# EAGLE design rpi2_ctrl (EAGLE 7.6.0)
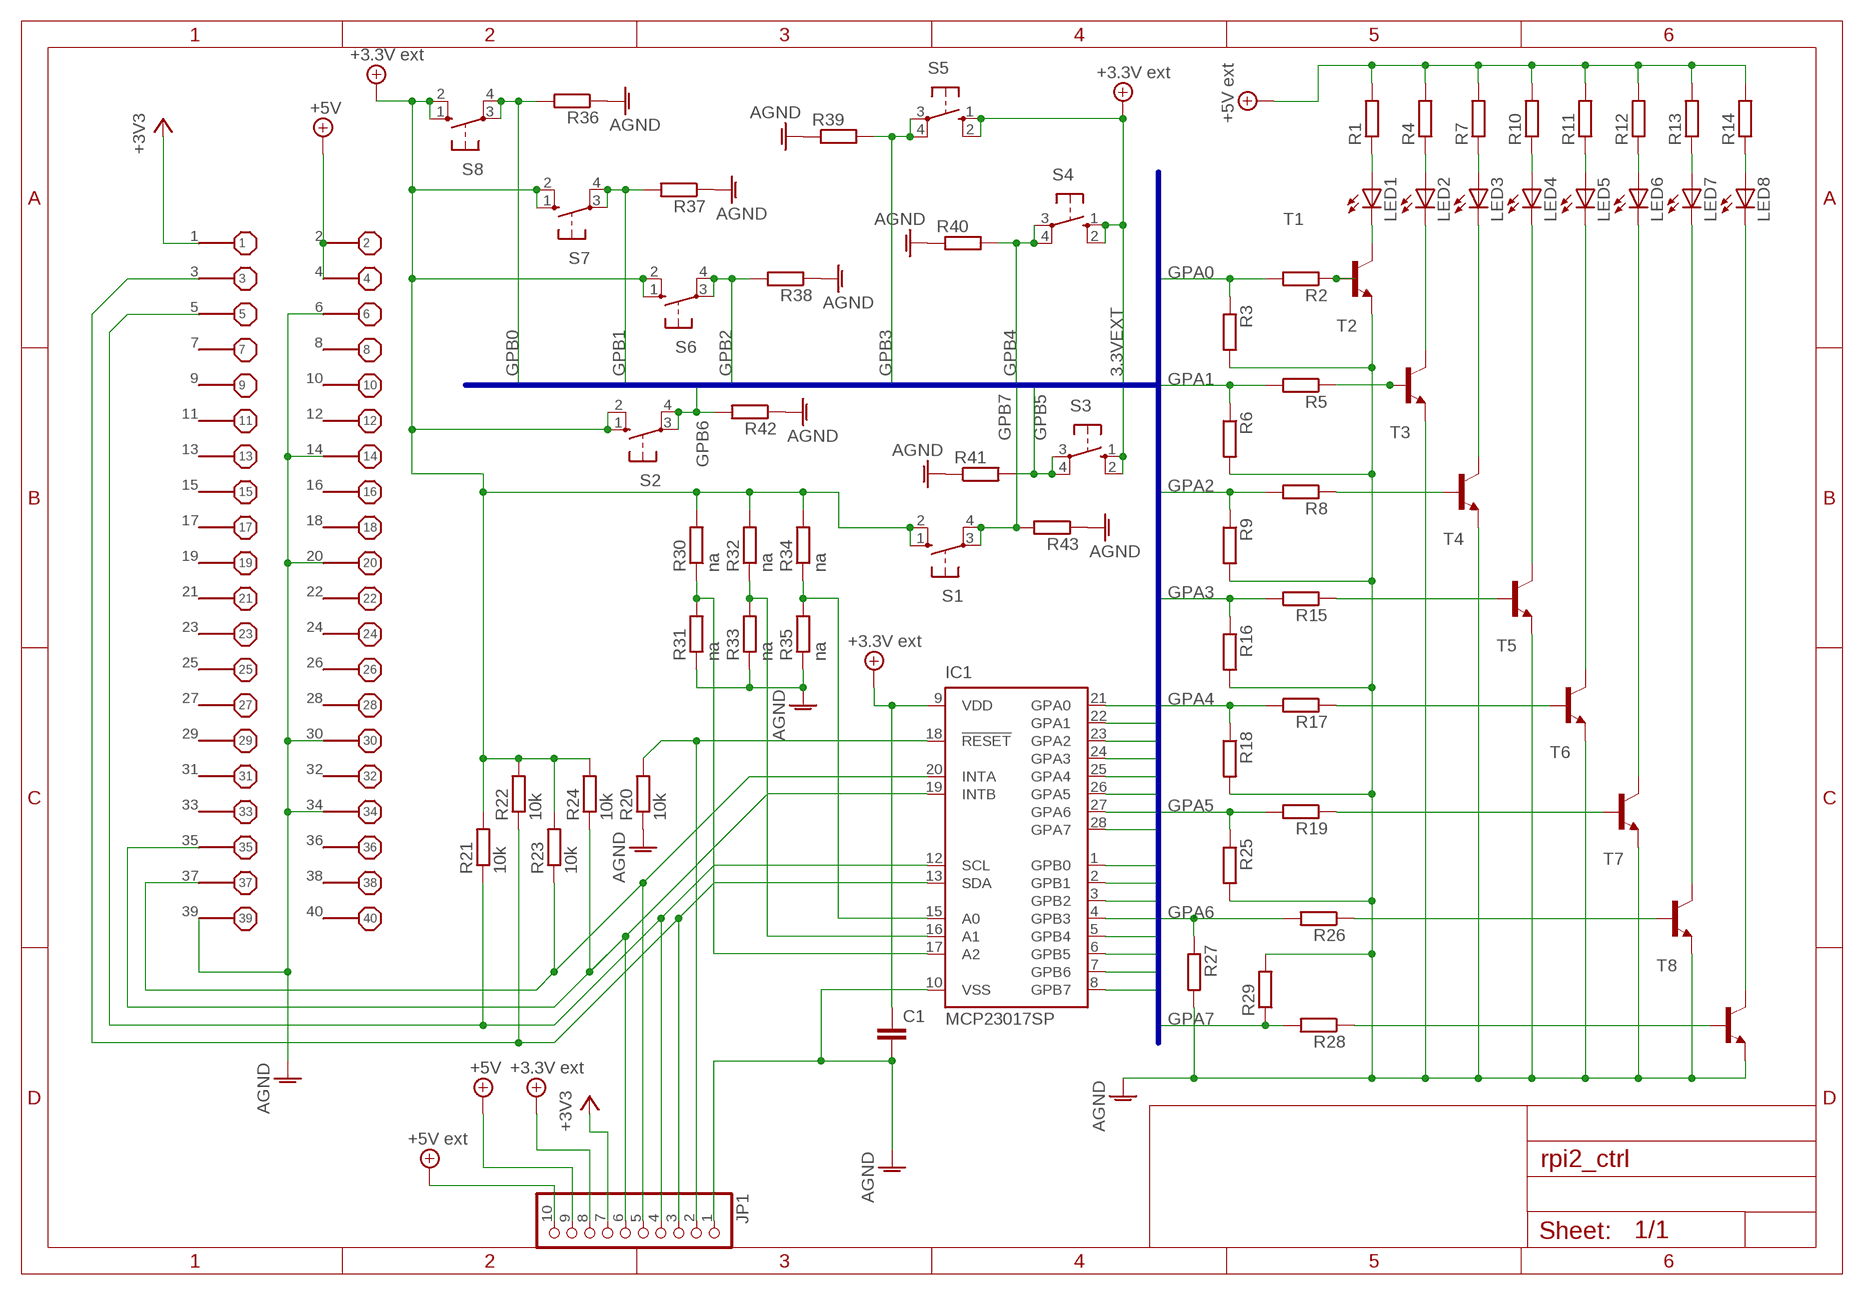
[diagram p0: schematic, sheet 1]

## Parts
C1  C-EUC1210  [C1210]
IC1  MCP23017SP  [DIL28-3]
JP1  PINHD-1X10  [1X10]
LED1  LED5MM  [LED5MM]
LED2  LED5MM  [LED5MM]
LED3  LED5MM  [LED5MM]
LED4  LED5MM  [LED5MM]
LED5  LED5MM  [LED5MM]
LED6  LED5MM  [LED5MM]
LED7  LED5MM  [LED5MM]
LED8  LED5MM  [LED5MM]
R1  R-EU_R0805  [R0805]
R2  R-EU_R0805  [R0805]
R3  R-EU_R0805  [R0805]
R4  R-EU_R0805  [R0805]
R5  R-EU_R0805  [R0805]
R6  R-EU_R0805  [R0805]
R7  R-EU_R0805  [R0805]
R8  R-EU_R0805  [R0805]
R9  R-EU_R0805  [R0805]
R10  R-EU_R0805  [R0805]
R11  R-EU_R0805  [R0805]
R12  R-EU_R0805  [R0805]
R13  R-EU_R0805  [R0805]
R14  R-EU_R0805  [R0805]
R15  R-EU_R0805  [R0805]
R16  R-EU_R0805  [R0805]
R17  R-EU_R0805  [R0805]
R18  R-EU_R0805  [R0805]
R19  R-EU_R0805  [R0805]
R20  10k  R-EU_R0805  [R0805]
R21  10k  R-EU_R0805  [R0805]
R22  10k  R-EU_R0805  [R0805]
R23  10k  R-EU_R0805  [R0805]
R24  10k  R-EU_R0805  [R0805]
R25  R-EU_R0805  [R0805]
R26  R-EU_R0805  [R0805]
R27  R-EU_R0805  [R0805]
R28  R-EU_R0805  [R0805]
R29  R-EU_R0805  [R0805]
R30  na  R-EU_R0805  [R0805]
R31  na  R-EU_R0805  [R0805]
R32  na  R-EU_R0805  [R0805]
R33  na  R-EU_R0805  [R0805]
R34  na  R-EU_R0805  [R0805]
R35  na  R-EU_R0805  [R0805]
R36  R-EU_R0805  [R0805]
R37  R-EU_R0805  [R0805]
R38  R-EU_R0805  [R0805]
R39  R-EU_R0805  [R0805]
R40  R-EU_R0805  [R0805]
R41  R-EU_R0805  [R0805]
R42  R-EU_R0805  [R0805]
R43  R-EU_R0805  [R0805]
S1  10-XX  [B3F-10XX]
S2  10-XX  [B3F-10XX]
S3  10-XX  [B3F-10XX]
S4  10-XX  [B3F-10XX]
S5  10-XX  [B3F-10XX]
S6  10-XX  [B3F-10XX]
S7  10-XX  [B3F-10XX]
S8  10-XX  [B3F-10XX]
T1  BC547-NPN-TO92-CBE  [TO92-CBE]
T2  BC547-NPN-TO92-CBE  [TO92-CBE]
T3  BC547-NPN-TO92-CBE  [TO92-CBE]
T4  BC547-NPN-TO92-CBE  [TO92-CBE]
T5  BC547-NPN-TO92-CBE  [TO92-CBE]
T6  BC547-NPN-TO92-CBE  [TO92-CBE]
T7  BC547-NPN-TO92-CBE  [TO92-CBE]
T8  BC547-NPN-TO92-CBE  [TO92-CBE]
X1  B+_GPIO  [B+_GPIO]

## Nets
3.3VEXT: C1.1 IC1.9(VDD) JP1.8 R21.2 R22.2 R23.2 R24.2 R30.2 R32.2 R34.2 S1.1(S) S1.2(S1) S2.1(S) S2.2(S1) S3.1(S) S3.2(S1) S4.1(S) S4.2(S1) S5.1(S) S5.2(S1) S6.1(S) S6.2(S1) S7.1(S) S7.2(S1) S8.1(S) S8.2(S1) ; supply symbol labelled +3.3V ext
+3V3: JP1.7 X1.1
+5V: JP1.9 X1.2 X1.4
+5V/1: JP1.10 R1.2 R4.2 R7.2 R10.2 R11.2 R12.2 R13.2 R14.2 ; supply symbol labelled +5V ext
AGND: C1.2 IC1.10(VSS) JP1.1 R3.2 R6.2 R9.2 R16.2 R18.2 R20.1 R25.2 R27.2 R29.2 R31.1 R33.1 R35.1 R36.1 R37.1 R38.1 R39.1 R40.1 R41.1 R42.1 R43.1 T1.E T2.E T3.E T4.E T5.E T6.E T7.E T8.E X1.6 X1.14 X1.20 X1.30 X1.34 X1.39
GPA0: IC1.21(GPA0) R2.2 R3.1
GPA1: IC1.22(GPA1) R5.2 R6.1
GPA2: IC1.23(GPA2) R8.2 R9.1
GPA3: IC1.24(GPA3) R15.2 R16.1
GPA4: IC1.25(GPA4) R17.2 R18.1
GPA5: IC1.26(GPA5) R19.2 R25.1
GPA6: IC1.27(GPA6) R26.2 R27.1
GPA7: IC1.28(GPA7) R28.2 R29.1
GPB0: IC1.1(GPB0) R36.2 S8.3(P) S8.4(P1)
GPB1: IC1.2(GPB1) R37.2 S7.3(P) S7.4(P1)
GPB2: IC1.3(GPB2) R38.2 S6.3(P) S6.4(P1)
GPB3: IC1.4(GPB3) R39.2 S5.3(P) S5.4(P1)
GPB4: IC1.5(GPB4) R40.2 S4.3(P) S4.4(P1)
GPB5: IC1.6(GPB5) R41.2 S3.3(P) S3.4(P1)
GPB6: IC1.7(GPB6) R42.2 S2.3(P) S2.4(P1)
GPB7: IC1.8(GPB7) R43.2 S1.3(P) S1.4(P1)
N$1: R2.1 T1.B
N$2: LED1.A R1.1
N$3: IC1.13(SDA) JP1.3 R22.1 X1.3
N$4: IC1.12(SCL) JP1.4 R21.1 X1.5
N$5: IC1.19(INTB) JP1.6 R24.1 X1.35
N$6: IC1.20(INTA) JP1.5 R23.1 X1.37
N$7: IC1.18(!RESET) JP1.2 R20.2
N$8: LED1.K(C) T1.C
N$9: R5.1 T2.B
N$10: LED2.A R4.1
N$11: LED2.K(C) T2.C
N$12: R8.1 T3.B
N$13: LED3.A R7.1
N$14: LED3.K(C) T3.C
N$15: R15.1 T4.B
N$16: LED4.K(C) T4.C
N$17: R17.1 T5.B
N$18: LED5.K(C) T5.C
N$19: R19.1 T6.B
N$20: LED6.K(C) T6.C
N$21: R26.1 T7.B
N$22: LED7.K(C) T7.C
N$23: IC1.17(A2) R30.1 R31.2
N$24: R28.1 T8.B
N$25: LED8.K(C) T8.C
N$26: LED8.A R14.1
N$27: LED7.A R13.1
N$28: LED6.A R12.1
N$29: IC1.16(A1) R32.1 R33.2
N$30: IC1.15(A0) R34.1 R35.2
N$31: LED5.A R11.1
N$32: LED4.A R10.1
Unconnected: X1.7 X1.8 X1.9 X1.10 X1.11 X1.12 X1.13 X1.15 X1.16 X1.17 X1.18 X1.19 X1.21 X1.22 X1.23 X1.24 X1.25 X1.26 X1.27 X1.28 X1.29 X1.31 X1.32 X1.33 X1.36 X1.38 X1.40

## Buses
GPA[0..7],GPB[0..7]

## Library data of the parts
C1 = rcl:C-EU: CAPACITOR, European symbol
IC1 = microchip:MCP23017: http://ww1.microchip.com/downloads/en/DeviceDoc/21952a.pdf Source: http://ww1.microchip.com/downloads/en/DeviceDoc/21952a.pdf; MF: MICROCHIP; MPN: MCP23017-E/SP; OC_FARNELL: 1332088; OC_NEWARK: 31K2959
JP1 = pinhead:PINHD-1X10: PIN HEADER
LED1-LED8 = led:LED: LED OSRAM: - CHIPLED LG R971, LG N971, LY N971, LG Q971, LY Q971, LO R971, LY R971 LH N974, LH R974 LS Q976, LO Q976, LY Q976 LO Q996 - Hyper CHIPLED LW Q18S LB Q993, LB Q99A, LB R99A - SideLED LS A670, LO A670, LY A670, LG A670, LP A670 LB A673, LV A673, LT A673, LW A673 LH A674 LY A675 LS A676, LA A676, LO A676, LY A676, LW A676 LS A679, LY A679, LG A679 - Hyper Micro SIDELED® LS Y876, LA Y876, LO Y876, LY Y876 LT Y87S - SmartLED LW L88C, LW L88S LB L89C, LB L89S, LG L890 LS L89K, LO L89K, LY L89K LS L896, LA L896, LO L896, LY L896 - TOPLED LS T670, LO T670, LY T670, LG T670, LP T670 LSG T670, LSP T670, LSY T670, LOP T670, LYG T670 LG T671, LOG T671, LSG T671 LB T673, LV T673, LT T673, LW T673 LH T674 LS T676, LA T676, LO T676, LY T676, LB T676, LH T676, LSB T676, LW T676 LB T67C, LV T67C, LT T67C, LS T67K, LO T67K, LY T67K, LW E67C LS E67B, LA E67B, LO E67B, LY E67B, LB E67C, LV E67C, LT E67C LW T67C LS T679, LY T679, LG T679 LS T770, LO T770, LY T770, LG T770, LP T770 LB T773, LV T773, LT T773, LW T773 LH T774 LS E675, LA E675, LY E675, LS T675 LS T776, LA T776, LO T776, LY T776, LB T776 LHGB T686 LT T68C, LB T68C - Hyper Mini TOPLED® LB M676 - Mini TOPLED Santana® LG M470 LS M47K, LO M47K, LY M47K Source: http://www.osram.convergy.de LUXEON: - LUMILED® LXK2-PW12-R00, LXK2-PW12-S00, LXK2-PW14-U00, LXK2-PW14-V00 LXK2-PM12-R00, LXK2-PM12-S00, LXK2-PM14-U00 LXK2-PE12-Q00, LXK2-PE12-R00, LXK2-PE12-S00, LXK2-PE14-T00, LXK2-PE14-U00 LXK2-PB12-K00, LXK2-PB12-L00, LXK2-PB12-M00, LXK2-PB14-N00, LXK2-PB14-P00, LXK2-PB14-Q00 LXK2-PR12-L00, LXK2-PR12-M00, LXK2-PR14-Q00, LXK2-PR14-R00 LXK2-PD12-Q00, LXK2-PD12-R00, LXK2-PD12-S00 LXK2-PH12-R00, LXK2-PH12-S00 LXK2-PL12-P00, LXK2-PL12-Q00, LXK2-PL12-R00 Source: www.luxeon.com KINGBRIGHT: KA-3528ASYC Source: www.kingbright.com
R1-R43 = rcl:R-EU_: RESISTOR, European symbol
S1-S8 = switch-omron:10-XX: OMRON SWITCH; MPN: B3F-1000; OC_FARNELL: 176432; OC_NEWARK: 36M3542
T1-T8 = transistor:*-NPN-: NPN Transistror BF959 corrected 2008.03.06
X1 = raspberry:B+_GPIO

## Board
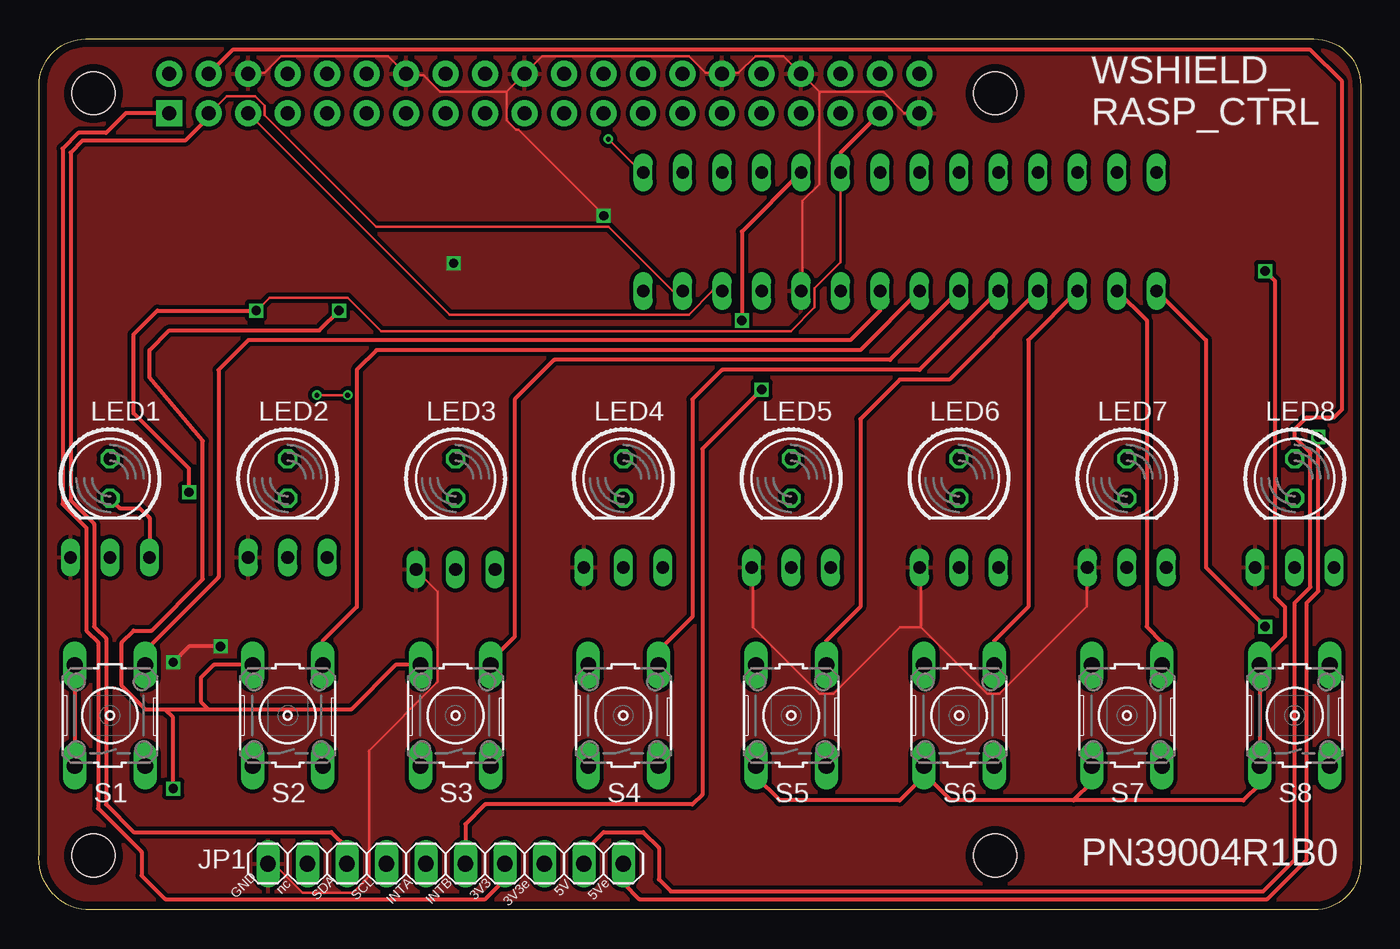
[diagram p1: board, top side]
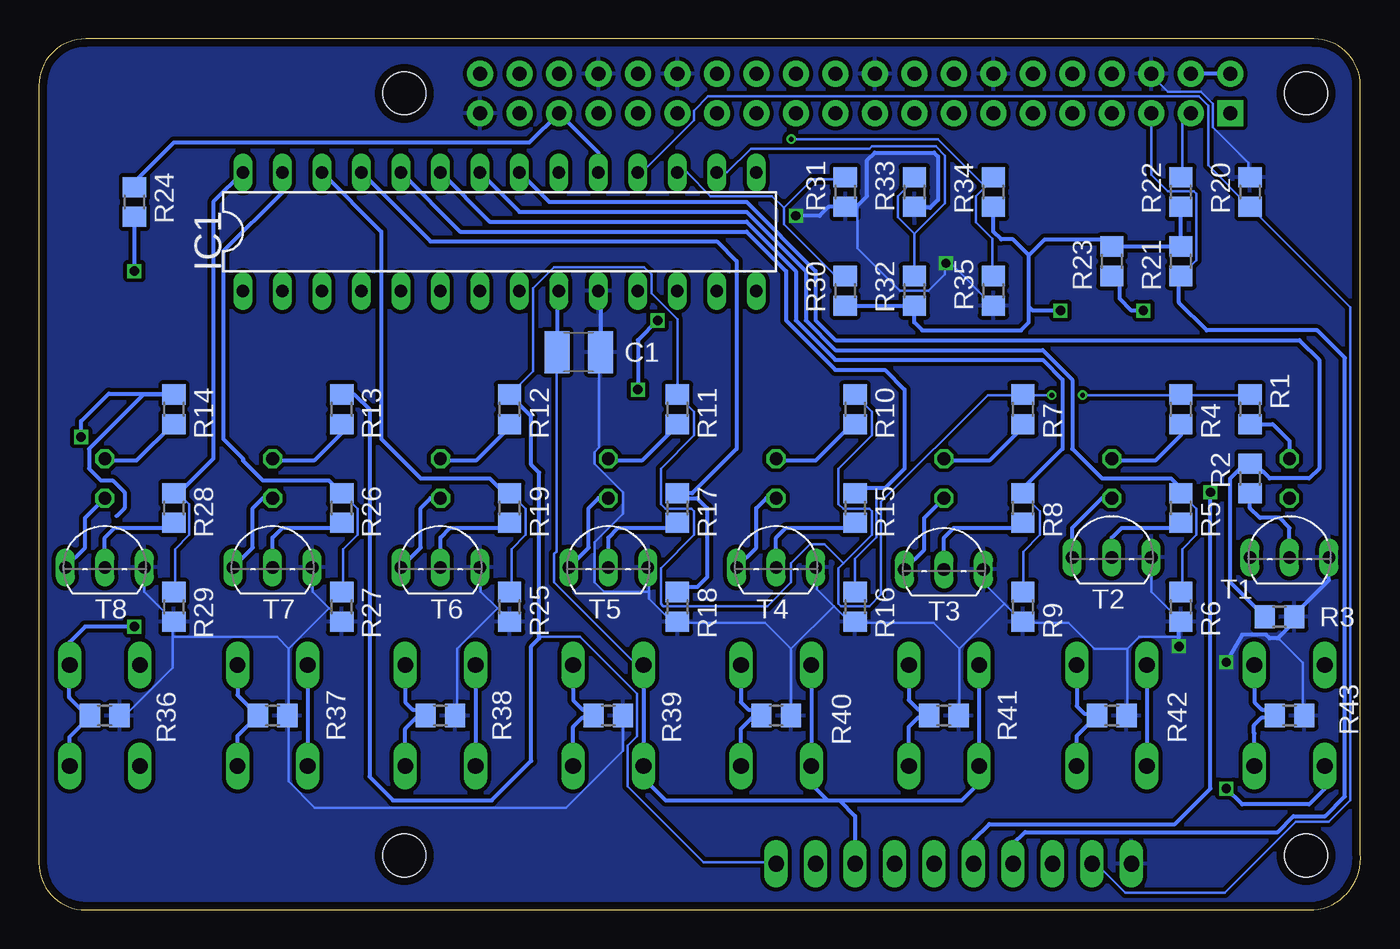
[diagram p2: board, bottom side, seen from below]

Size 85.02 x 56 mm. Coordinates in mm from the lower left corner, seen from the top.
Outline: 0.02,53 arc-90 3.02,56 82.02,56 arc-90 85.02,53 85.02,3 arc-90 82.02,0 3.02,0 arc-90 0.02,3.64 0.02,53
Copper layers (1*16): Top 0.035mm / dielectric 1.6mm / Bottom 0.035mm
Design rules "Elecrow_2-layer_PCB_eagle_rule": minimum track width 6mil, minimum drill 12mil, track to track 6mil, track to pad 6mil, pad to pad 6mil, via to via 8mil, smd to smd 0mil, copper to edge 20mil, drill to drill 10mil, minimum pad ring 6mil, minimum via ring 6mil, stop-mask expansion 0mil, vias tented up to drill 100mil, thermal gap 10mil
Holes 2.75 mm at 3.52,52.5 3.52,3.5 61.52,52.5 61.52,3.5

### Footprints (pad centres in the part's own frame; a part is rotated, then mirrored left to right if it is on the bottom)
C1210 = smd 1.6 x 2.7: 1 -1.4,0; 2 1.4,0
DIL28-3 = drill 0.813 long: 1 -16.51,-3.81; 2 -13.97,-3.81; 3 -11.43,-3.81; 4 -8.89,-3.81; 5 -6.35,-3.81; 6 -3.81,-3.81; 7 -1.27,-3.81; 8 1.27,-3.81; 9 3.81,-3.81; 10 6.35,-3.81; 11 8.89,-3.81; 12 11.43,-3.81; 13 13.97,-3.81; 14 16.51,-3.81; 15 16.51,3.81; 16 13.97,3.81; 17 11.43,3.81; 18 8.89,3.81; 19 6.35,3.81; 20 3.81,3.81; 21 1.27,3.81; 22 -1.27,3.81; 23 -3.81,3.81; 24 -6.35,3.81; 25 -8.89,3.81; 26 -11.43,3.81; 27 -13.97,3.81; 28 -16.51,3.81
1X10 = drill 1.016 long: 1 -11.43,0; 2 -8.89,0; 3 -6.35,0; 4 -3.81,0; 5 -1.27,0; 6 1.27,0; 7 3.81,0; 8 6.35,0; 9 8.89,0; 10 11.43,0
LED5MM = drill 0.813 octagon: A -1.27,0; K 1.27,0
R0805 = smd 1.3 x 1.5: 1 -0.95,0; 2 0.95,0
B3F-10XX = drill 1.016 long: 1 -3.251,2.261; 2 3.251,2.261; 3 -3.251,-2.261; 4 3.251,-2.261
TO92-CBE = drill 0.813 long: B 0,0; C -2.54,0; E 2.54,0
B+_GPIO = drill 0.9 pad 1.676 square: 1 -24.13,-1.27 | drill 0.9 pad 1.676: 2 -24.13,1.27; 3 -21.59,-1.27; 4 -21.59,1.27; 5 -19.05,-1.27; 6 -19.05,1.27; 7 -16.51,-1.27; 8 -16.51,1.27; 9 -13.97,-1.27; 10 -13.97,1.27; 11 -11.43,-1.27; 12 -11.43,1.27; 13 -8.89,-1.27; 14 -8.89,1.27; 15 -6.35,-1.27; 16 -6.35,1.27; 17 -3.81,-1.27; 18 -3.81,1.27; 19 -1.27,-1.27; 20 -1.27,1.27; 21 1.27,-1.27; 22 1.27,1.27; 23 3.81,-1.27; 24 3.81,1.27; 25 6.35,-1.27; 26 6.35,1.27; 27 8.89,-1.27; 28 8.89,1.27; 29 11.43,-1.27; 30 11.43,1.27; 31 13.97,-1.27; 32 13.97,1.27; 33 16.51,-1.27; 34 16.51,1.27; 35 19.05,-1.27; 36 19.05,1.27; 37 21.59,-1.27; 38 21.59,1.27; 39 24.13,-1.27; 40 24.13,1.27

### Placement (x,y rotation side)
C1  50.3,35.86 0 bottom
IC1  55.38,43.61 0 bottom
JP1  26.17,2.97 0 top
LED1  4.58,27.73 270 top
LED2  16.01,27.73 270 top
LED3  26.8,27.73 270 top
LED4  37.6,27.73 270 top
LED5  48.39,27.73 270 top
LED6  59.19,27.73 270 top
LED7  69.98,27.73 270 top
LED8  80.78,27.73 270 top
R1  7.12,32.18 90 bottom
R2  7.12,27.73 90 bottom
R3  5.21,18.84 0 bottom
R4  11.56,32.18 90 bottom
R5  11.56,25.83 90 bottom
R6  11.56,19.48 270 bottom
R7  21.72,32.18 90 bottom
R8  21.72,25.83 90 bottom
R9  21.72,19.48 270 bottom
R10  32.52,32.18 90 bottom
R11  43.95,32.18 90 bottom
R12  54.74,32.18 90 bottom
R13  65.54,32.18 90 bottom
R14  76.33,32.18 90 bottom
R15  32.52,25.83 90 bottom
R16  32.52,19.48 270 bottom
R17  43.95,25.83 90 bottom
R18  43.95,19.48 270 bottom
R19  54.74,25.83 90 bottom
R20  7.12,46.15 270 bottom
R21  11.56,41.7 90 bottom
R22  11.56,46.15 270 bottom
R23  16.01,41.7 90 bottom
R24  78.87,45.52 270 bottom
R25  54.74,19.48 270 bottom
R26  65.54,25.83 90 bottom
R27  65.54,19.48 270 bottom
R28  76.33,25.83 90 bottom
R29  76.33,19.48 270 bottom
R30  33.15,39.8 270 bottom
R31  33.15,46.15 90 bottom
R32  28.71,39.8 270 bottom
R33  28.71,46.15 90 bottom
R34  23.63,46.15 270 bottom
R35  23.63,39.8 90 bottom
R36  80.78,12.5 180 bottom
R37  69.98,12.5 180 bottom
R38  59.19,12.5 180 bottom
R39  48.39,12.5 180 bottom
R40  37.6,12.5 180 bottom
R41  26.8,12.5 180 bottom
R42  16.01,12.5 180 bottom
R43  4.58,12.5 180 bottom
S1  4.58,12.5 90 top
S2  16.01,12.5 90 top
S3  26.8,12.5 90 top
S4  37.6,12.5 90 top
S5  48.39,12.5 90 top
S6  59.19,12.5 90 top
S7  69.98,12.5 90 top
S8  80.78,12.5 90 top
T1  4.58,22.66 0 bottom
T2  16.01,22.66 0 bottom
T3  26.8,21.89 0 bottom
T4  37.6,22.02 0 bottom
T5  48.39,22.02 0 bottom
T6  59.19,22.02 0 bottom
T7  69.98,22.02 0 bottom
T8  80.78,22.02 0 bottom
X1  32.52,52.5 0 top

### Tracks (layer width: path | path; a pad name or v marks a point on that pad's centre or on a via)
3.3VEXT  (via drill 0.6)
  Top 0.254: S3.2 22.94,15.75 20.07,12.88 10.93,12.88 | 10.93,12.88 8.13,12.88 | 8.13,12.88 6.86,12.88 5.34,14.4 5.34,17.19 6.1,17.96 7.24,17.96 10.54,21.26 10.54,30.15 7.12,34.21 7.12,35.99 8.39,37.26 18.04,37.26 v19.31,38.53 | S5.1 46.13,8.56 47.65,7.03 55.38,7.03 56.92,8.58 S6.1 56.9,9.22 56.9,8.81 58.68,7.03 66.55,7.03 | S7.1 67.72,8.2 66.55,7.03 | S2.2 11.26,15.75 10.42,14.91 10.42,13.38 10.93,12.88 | v8.64,7.8 8.64,12.37 8.13,12.88 | S1.2 S1.1 | 66.55,7.03 77.47,7.03 78.51,8.08 S8.1 S8.2 78.51,15.95 80.14,17.57 80.14,19.48 79.51,20.12 79.51,40.44 v78.87,41.07
  Bottom 0.152: C1.1 51.72,35.84 51.72,23.04 51.87,22.88 51.87,21.05 46.69,15.87 46.23,15.87 S5.2
  Bottom 0.254: S7.2 S7.1 | S6.2 S6.1 | S2.2 S2.1 | R30.2 R32.2 28.71,37.77 28.2,37.26 21.85,37.26 21.34,37.77 21.34,38.78 | R22.2 R21.2 R23.2 16.01,42.59 16.39,42.98 | S5.2 S5.1 46.13,8.46 44.71,7.03 34.29,7.03 | S4.2 S4.1 35.33,8.08 34.29,7.03 | S3.2 S3.1 24.64,9.14 24.64,8.05 25.66,7.03 33.53,7.03 | 21.34,38.78 21.34,42.09 | 21.34,42.09 22.36,43.1 23.12,43.1 23.63,43.61 R34.2 | 21.34,42.09 20.32,43.1 16.39,43.1 16.39,42.98 | 16.45,43.1 16.51,43.1 16.39,42.98 | v19.31,38.53 21.09,38.53 21.34,38.78 | 34.29,7.03 33.53,7.03 | 33.53,7.03 32.52,6.02 JP1.8 | S1.1 2.31,7.77 3.31,6.78 7.62,6.78 v8.64,7.8 | IC1.9 51.7,39.67 C1.1 | R24.2 v78.87,41.07
+3V3
  Top 0.254: X1.1 5.59,51.23 4.32,49.96 2.54,49.96 1.53,48.94 1.53,26.08 3.05,24.56 3.05,17.96 3.81,17.19 3.81,6.53 6.61,3.73 6.61,2.21 8.13,0.68 28.71,0.68 29.98,1.95 JP1.7
+5V
  Top 0.254: JP1.9 35.06,3.73 36.33,5 38.87,5 39.88,3.99 39.88,1.95 40.64,1.19 78.74,1.19 80.78,3.22 80.78,19.73 81.79,20.75 81.79,29.39 80.78,30.4 80.78,30.91 81.54,31.67 83.32,31.67 83.82,32.18 83.82,53.26 81.79,55.29 12.45,55.29 X1.4
  Bottom 0.254: X1.2 X1.4
+5V/1  (via drill 0.3, 0.6)
  Top 0.152: v19.87,33.09 v17.89,33.09
  Top 0.254: JP1.10 37.6,1.7 38.61,0.68 79,0.68 81.54,3.22 81.54,19.73 82.3,20.5 v82.3,30.4
  Bottom 0.152: R1.2 7.22,33.09 11.48,33.09 R4.2 11.64,33.09 v17.89,33.09 | 33.28,22.27 31.45,24.1 31.45,25.63 31.6,25.78 33.28,25.78 33.58,26.08 33.58,28.37 31.45,30.5 31.45,32.03 32.52,33.09 R10.2 | 33.28,22.27 33.58,21.97 33.58,19.68 33.43,19.53 31.6,19.53 30.84,20.29 30.84,26.24 23.98,33.09 21.85,33.09 R7.2 21.7,33.09 v19.87,33.09 | R12.2 54.61,33.25 53.24,34.62 53.24,39.95 51.87,41.32 46.08,41.32 45.62,40.87 45.62,39.65 43.95,37.97 R11.2 43.95,33.09 42.88,32.03 42.88,30.5 45.01,28.37 45.01,26.08 44.71,25.78 43.03,25.78 42.88,25.63 42.88,24.1 45.01,21.97 45.01,19.68 44.86,19.53 38.15,19.53 36.63,21.05 36.63,22.27 35.41,23.49 34.5,23.49 33.28,22.27 | 52.84,17.45 52.78,17.55 50.19,17.55 46.54,13.89 46.54,11.15 47.15,10.54 47.15,7.95 42.27,3.07 37.7,3.07 JP1.10
  Bottom 0.254: v82.3,30.4 82.3,31.42 80.52,33.2 76.4,33.2 R14.2 78.3,33.13 81.79,29.64 81.79,28.37 81.03,27.61 80.27,27.61 79.51,26.85 79.51,25.83 80.01,25.32 | R13.2 64.71,33.13 63.76,32.18 63.76,8.56 62.23,7.03 55.88,7.03 53.34,9.57 53.34,16.94 52.84,17.45 52.84,28.12 53.34,28.62 53.34,31.73 R12.2
AGND  (via drill 0.6)
  Top 0.152: 43.95,53.82 45.01,53.82 46.08,54.89 47.91,54.89 X1.34 50.19,52.6 | X1.39 55.68,51.23 54.31,52.6 50.19,52.6 | 50.19,52.6 50.19,46.66 49.13,45.59 49.13,39.8 IC1.10 | 30.08,52.6 25.81,52.6 24.74,53.67 23.68,53.67 X1.14 23.52,53.82 22.46,54.89 15.6,54.89 14.53,53.82 13.47,53.82 X1.6 | 30.08,52.6 X1.20 32.36,54.89 41.81,54.89 42.88,53.82 43.95,53.82 | 30.08,52.6 30.08,50.77 30.69,50.16 30.84,50.16 36.33,44.68 v36.33,44.63 | 43.95,53.82 X1.30 | 56.75,18.16 56.75,21.97 T6.E | 56.75,18.16 61.01,13.89 61.78,13.89 67.42,19.53 67.42,21.97 T7.E | JP1.1 14.84,2.92 15.14,2.92 16.97,1.09 20.17,1.09 21.24,2.16 21.24,10.23 25.66,14.65 25.66,20.45 24.29,21.82 T3.E | 56.75,18.16 55.38,18.16 51.11,13.89 50.19,13.89 45.93,18.16 45.93,21.97 T5.E
  Top 0.254: v11.69,16.94 9.66,16.94 v8.64,15.92
  Bottom 0.152: R20.1 7.22,47.12 7.22,48.03 9.5,50.32 9.5,51.84 10.27,52.6 12.4,52.6 13.47,53.67 X1.6 | R35.1 23.68,38.89 26.27,41.48 26.57,41.48 v26.67,41.58 26.72,41.48 26.72,40.87 27.79,39.8 29.62,39.8 32.36,42.54 32.36,45.13 32.44,45.21 | T8.E 78.24,20.45 76.41,18.62 R29.2 76.41,18.46 76.41,17.55 | 76.41,17.55 76.41,15.57 79.45,12.52 79.76,12.52 R36.1 | 55.53,19.38 56.59,20.45 56.59,21.97 T6.E | 55.53,19.38 54.77,18.62 R25.2 | 55.53,19.38 58.12,16.79 58.12,12.52 R38.1 | 66.35,19.38 67.42,20.45 67.42,21.97 T7.E | 66.35,19.38 65.59,18.62 R27.2 | R39.1 47.45,12.37 47.45,10.23 51.11,6.58 67.26,6.58 68.94,8.25 68.94,12.37 R37.1 68.94,12.52 68.94,16.79 | 68.94,16.79 66.35,19.38 | 76.41,17.55 69.7,17.55 68.94,16.79 | 45.77,20.45 45.77,21.97 T5.E | 45.77,20.45 45.77,19.99 44.4,18.62 43.95,18.62 R18.2 43.95,18.46 38.31,18.46 36.63,16.79 | 33.89,19.53 34.95,20.6 34.95,21.97 T4.E | 33.89,19.53 32.97,18.62 32.52,18.62 R16.2 32.52,18.46 27.49,18.46 25.81,16.79 | 36.63,16.79 36.63,12.52 R40.1 | 33.89,19.53 36.63,16.79 | R43.1 3.71,12.52 3.71,15.87 5.24,17.4 5.34,17.45 | 14.99,16.79 14.99,12.52 R42.1 | 14.99,16.79 14.23,17.55 11.69,17.55 | T2.E 13.47,20.45 11.64,18.62 R6.2 | 22.91,19.68 24.13,20.9 24.13,21.82 T3.E | 22.91,19.68 21.85,18.62 R9.2 21.7,18.46 18.8,18.46 17.12,16.79 14.99,16.79 | 25.81,16.79 25.81,12.52 R41.1 | 22.91,19.68 25.81,16.79 | 45.77,20.45 48.67,20.45 49.28,21.05 49.28,23.65 47.45,25.47 47.45,26.85 49.28,28.68 49.28,29.44 48.97,29.74 48.97,35.84 C1.2
  Bottom 0.254: R33.1 28.64,45.13 27.69,45.13 27.18,45.64 27.18,48.44 27.44,48.69 31.25,48.69 31.75,48.18 31.75,45.9 32.44,45.21 32.45,45.2 R31.1 34.23,45.2 34.8,44.63 v36.33,44.63 | v8.64,15.92 7.62,17.7 6.1,17.7 5.85,17.45 5.34,17.45 4.26,18.53 R3.2 4.32,18.91 2.04,21.19 T1.E | v11.69,16.94 11.69,17.55 11.69,18.4 R6.2 | IC1.10 48.9,39.67 C1.2
  pour Top (isolate 0.254): 0.13,52.5 arc-90 3.94,56.31 4.58,56.31 82.68,56.31 arc-90 85.22,53.77 85.22,52.5 85.22,2.97 arc-90 82.05,-0.2 81.41,-0.2 3.31,-0.2 arc-90 0.13,2.97 0.13,3.6
  pour Bottom (isolate 0.254): 0.13,53.13 arc-90 3.31,56.31 3.94,56.31 82.05,56.31 arc-90 85.22,53.13 85.22,2.97 arc-90 82.05,-0.2 81.41,-0.2 3.31,-0.2 arc-90 0.13,2.97
GPA0
  Bottom 0.254: R3.1 8.39,21.07 8.39,27.73 7.44,28.69 R2.2 6.8,28.69 5.85,27.73 3.31,27.73 2.67,28.37 2.67,35.36 3.94,36.62 33.79,36.62 35.06,37.9 35.06,41.07 39.5,45.52 52.2,45.52 IC1.21
GPA1
  Bottom 0.152: R6.1 11.48,20.45 11.48,23.19 10.57,24.1 10.57,25.78 11.48,26.69 R5.2
  Bottom 0.254: IC1.22 54.11,44.88 39.5,44.88 35.69,41.07 35.69,37.9 33.79,35.99 20.45,35.99 18.55,34.09 18.55,29.64 16.64,27.73 12.2,27.73 11.56,27.1 R5.2
GPA2
  Bottom 0.152: R9.1 21.7,20.45 21.7,23.04 20.63,24.1 20.63,25.63 21.7,26.69 R8.2
  Bottom 0.254: IC1.23 56.01,44.24 39.5,44.24 36.33,41.07 36.33,37.9 33.79,35.36 20.45,35.36 19.18,34.09 19.18,29.64 21.72,27.1 R8.2
GPA3
  Bottom 0.152: R16.1 32.52,22.58 31.14,23.95 31.14,27.1
  Bottom 0.254: IC1.24 57.92,43.61 39.5,43.61 36.96,41.07 36.96,37.9 33.79,34.72 30.61,34.72 29.34,33.45 29.34,28.37 30.61,27.1 31.14,27.1 31.88,27.1 32.2,26.78 R15.2
GPA4
  Bottom 0.254: IC1.25 59.82,42.98 41.41,42.98 40.14,41.7 40.14,29.64 43,26.78 R17.2 43.63,26.46 42.68,26.46 42.04,25.83 42.04,21.39 42.68,20.75 43.31,20.75 43.63,20.43 R18.1
GPA5
  Bottom 0.152: R25.1 54.61,20.45 54.61,23.19 53.7,24.1 53.7,25.78 54.61,26.69 R19.2
  Bottom 0.254: IC1.26 63,43.61 63,30.27 60.46,27.73 56.01,27.73 55.06,26.78 R19.2
GPA6
  Bottom 0.152: R27.1 65.43,20.45 65.43,23.19 64.52,24.1 64.52,25.78 65.43,26.69 R26.2
  Bottom 0.254: R26.2 66.36,27.61 70.62,27.61 71.89,28.88 71.89,29 73.16,30.27 73.16,42.34 69.35,46.15 IC1.27
GPA7
  Bottom 0.152: R29.1 76.25,20.45 76.25,23.19 75.34,24.1 75.34,26.08 75.95,26.69 R28.2
  Bottom 0.254: IC1.28 73.79,45.52 73.79,29 76.02,26.78 R28.2
GPB0  (via drill 0.6)
  Top 0.254: IC1.1 75.06,36.62 75.06,22.02 v78.87,18.21
  Bottom 0.254: S8.3 83.06,9.27 83.06,11.1 81.73,12.43 R36.2 81.92,12.5 83.06,13.64 83.06,15.72 S8.4 83.04,17.22 82.05,18.21 v78.87,18.21
GPB1
  Top 0.254: IC1.2 71.25,37.9 71.25,18.21 72.24,17.22 S7.4
  Bottom 0.254: S7.4 72.24,13.81 R37.2 72.24,11.18 S7.3
GPB2
  Top 0.254: IC1.3 63.63,36.62 63.63,19.48 61.45,17.3 S6.4
  Bottom 0.254: S6.3 61.45,11.63 60.71,12.37 60.26,12.37 R38.2 60.52,12.88 60.96,12.88 61.45,13.36 S6.4
GPB3
  Top 0.254: IC1.4 58.55,34.09 55.38,34.09 52.84,31.55 52.84,19.48 50.65,17.3 S5.4
  Bottom 0.254: S5.3 50.65,11.76 50.04,12.37 49.47,12.37 R39.2 49.72,12.88 50.04,12.88 50.65,13.49 S5.4
GPB4
  Top 0.254: IC1.5 56.65,34.72 43.95,34.72 42.04,32.81 42.04,18.84 39.86,16.66 S4.4
  Bottom 0.254: S4.3 39.86,11.63 39.12,12.37 38.67,12.37 R40.2 38.93,12.88 39.37,12.88 39.86,13.36 S4.4
GPB5
  Top 0.254: IC1.6 54.74,35.36 33.15,35.36 30.61,32.81 30.61,17.57 29.06,16.03 S3.4
  Bottom 0.254: S3.3 29.06,11.76 28.45,12.37 27.88,12.37 R41.2 28.13,12.88 28.45,12.88 29.06,13.49 S3.4
GPB6
  Top 0.254: IC1.7 52.84,35.99 21.72,35.99 20.45,34.72 20.45,19.48 18.27,17.3 S2.4
  Bottom 0.254: S2.4 18.27,13.11 17.78,12.62 17.08,12.62 R42.2 18.27,11.18 S2.3
GPB7
  Top 0.254: IC1.8 54.11,38.53 52.2,36.62 13.47,36.62 11.56,34.72 11.56,21.39 6.84,16.66 S1.4
  Bottom 0.254: S1.3 6.84,11.33 6.86,11.35 6.86,11.86 6.35,12.37 5.65,12.37 R43.2 5.91,12.88 6.35,12.88 6.84,13.36 S1.4
N$1
  Bottom 0.254: T1.B 4.58,24.56 5.21,25.2 6.48,25.2 7.12,25.83 R2.1
N$2
  Bottom 0.254: R1.1 5.66,31.23 4.58,30.15 LED1.A
N$3
  Top 0.152: IC1.13 40.75,39.8 36.63,43.91 21.7,43.91 14.53,51.08 14.53,51.69 13.92,52.3 12.09,52.3 11.03,51.23 X1.3
  Top 0.254: X1.3 10.93,50.98 9.4,49.45 2.8,49.45 2.04,48.69 2.04,26.34 3.56,24.81 3.56,18.21 4.32,17.45 4.32,6.78 6.1,5 18.8,5 19.82,3.99 JP1.3
  Bottom 0.152: R22.1 11.48,47.12 11.48,50.77 11.03,51.23 X1.3
N$4
  Top 0.152: IC1.12 43.34,39.8 41.81,38.28 26.42,38.28 X1.5
  Bottom 0.152: X1.5 13.47,47.27 12.4,46.2 10.72,46.2 10.57,46.05 10.57,41.78 11.48,40.87 R21.1
  Bottom 0.254: JP1.4 22.36,4.24 21.59,5 5.34,5 4.32,6.02 2.29,6.02 1.02,7.29 1.02,35.48 2.8,37.26 9.91,37.26 11.69,39.04 11.69,40.63 R21.1
N$5  (via drill 0.6)
  Top 0.254: IC1.19 45.22,43.61 v45.22,37.9 | v46.49,33.45 42.68,29.64 42.68,7.42 42.04,6.78 28.71,6.78 27.44,5.51 JP1.6
  Bottom 0.254: R24.1 78.87,46.79 76.33,49.33 53.47,49.33 X1.35 49.03,48.69 IC1.19 | v45.22,37.9 46.49,36.62 v46.49,33.45
N$6  (via drill 0.6)
  Top 0.152: IC1.20 51.57,41.63 49.89,39.95 49.89,38.73 48.37,37.21 22,37.21 19.87,39.34 14.84,39.34 14.08,38.58 v13.97,38.53
  Top 0.254: v9.66,26.85 9.66,28.37 6.1,31.93 6.1,37.01 7.62,38.53 v13.97,38.53 | X1.37 51.57,48.69 IC1.20
  Bottom 0.254: JP1.5 24.9,4.49 23.88,5.51 11.94,5.51 9.66,7.8 v9.66,26.85 | v13.97,38.53 14.74,38.53 15.5,39.29 15.5,40.25 R23.1
N$7
  Bottom 0.152: IC1.18 46.23,47.42 42.88,50.77 42.88,51.38 41.96,52.3 10.42,52.3 9.81,51.69 9.81,47.88 7.22,45.29 R20.2 7.06,45.13 0.66,38.73 0.66,7.03 2.04,5.66 4.17,5.66 8.74,1.09 15.14,1.09 16.97,2.92 17.28,2.92 JP1.2
N$8
  Top 0.254: LED1.K 5.21,25.83 6.48,25.83 7.12,25.2 T1.C
N$9
  Bottom 0.254: T2.B 16.01,23.93 15.37,24.56 12.2,24.56 11.88,24.88 R5.1
N$10
  Bottom 0.254: R4.1 11.56,30.53 13.21,28.88 15.88,28.88 LED2.A
N$11
  Bottom 0.254: T2.C 18.55,24.56 16.64,26.46 LED2.K
N$12
  Bottom 0.254: T3.B 26.8,23.93 26.17,24.56 22.36,24.56 22.04,24.88 R8.1
N$13
  Bottom 0.254: R7.1 21.72,31.04 23.88,28.88 26.67,28.88 LED3.A
N$14
  Bottom 0.254: T3.C 28.07,23.16 28.07,25.2 LED3.K
N$15
  Bottom 0.254: T4.B 37.6,23.93 36.96,24.56 33.15,24.56 32.83,24.88 R15.1
N$16
  Bottom 0.254: T4.C 38.87,23.29 38.87,25.83 38.23,26.46 LED4.K
N$17
  Bottom 0.254: T5.B 48.39,23.93 47.76,24.56 44.58,24.56 44.26,24.88 R17.1
N$18
  Bottom 0.254: T5.C 49.66,23.29 49.66,25.83 49.03,26.46 LED5.K
N$19
  Bottom 0.254: T6.B 59.19,23.93 58.55,24.56 55.38,24.56 55.06,24.88 R19.1
N$20
  Bottom 0.254: T6.C 60.46,23.29 60.46,25.83 59.82,26.46 LED6.K
N$21
  Bottom 0.254: T7.B 69.98,23.93 69.35,24.56 66.17,24.56 65.85,24.88 R26.1
N$22
  Bottom 0.254: T7.C 71.25,23.29 71.25,25.83 70.62,26.46 LED7.K
N$23
  Bottom 0.152: 37.09,45.13 37.09,44.07 33.89,40.87 33.28,40.87 R30.1 | 37.09,45.13 35.26,46.96 33.28,46.96 R31.2 | IC1.17 43.34,47.42 41.81,45.9 37.85,45.9 37.09,45.13
N$24
  Bottom 0.254: T8.B 80.78,23.93 80.14,24.56 76.97,24.56 76.65,24.88 R28.1
N$25
  Bottom 0.254: T8.C 82.05,23.29 82.05,25.2 LED8.K
N$26
  Bottom 0.254: R14.1 76.39,31.23 78.74,28.88 80.65,28.88 LED8.A
N$27
  Bottom 0.254: R13.1 65.54,30.66 67.31,28.88 69.85,28.88 LED7.A
N$28
  Bottom 0.254: R12.1 54.74,31.04 56.9,28.88 59.06,28.88 LED6.A
N$29
  Bottom 0.152: 28.71,43.46 R32.1 | 28.71,43.46 29.77,44.52 29.77,45.9 28.71,46.96 R33.2 | IC1.16 40.75,47.42 39.22,48.94 31.6,48.94 31.45,49.1 27.33,49.1 26.72,48.49 26.72,45.44 28.71,43.46
N$30  (via drill 0.3)
  Top 0.152: v36.63,49.55 38.76,47.42 IC1.15
  Bottom 0.152: 24.13,46.51 23.68,46.96 R34.1 24.13,46.51 | 24.13,46.51 24.74,45.9 24.74,44.22 23.68,43.15 23.68,40.87 R35.2 | v36.63,49.55 27.18,49.55 24.13,46.51
N$31
  Bottom 0.254: R11.1 43.95,31.16 46.23,28.88 48.26,28.88 LED5.A
N$32
  Bottom 0.254: R10.1 32.7,31.23 35.06,28.88 37.47,28.88 LED4.A

### Text on the board
tNames: WSHIELD_ / RASP_CTRL | PN39004R1B0 | GND | nc | SDA | SCL | 3V3 | 5V | 5Ve | INTA | INTB | 3V3e
tTest: GND | SDA | SCL | INTB | INTA | 3.3V | 3.3Ve | 5V | 5Ve